# Altium schematic sheet FRAM.SchDoc
size 420 x 297 mm; DocumentNumber: 12; SheetNumber: 12; SheetTotal: 17
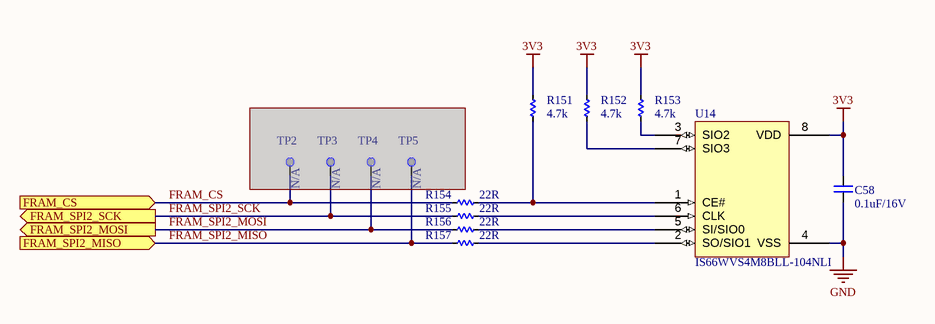
[diagram p0: FRAM.SchDoc]

## Parts
C58  0.1uF/16V  [CAP_C_1608X80]
R151  4.7k  [RES_C_1608X60]
R152  4.7k  [RES_C_1608X60]
R153  4.7k  [RES_C_1608X60]
R154  22R  [RES_C_1608X60]
R155  22R  [RES_C_1608X60]
R156  22R  [RES_C_1608X60]
R157  22R  [RES_C_1608X60]
TP2  Test Point  [TESTPOINT]  (value not drawn)  (no BOM)  (masked out: inside a compile mask, not in the netlist)
TP3  Test Point  [TESTPOINT]  (value not drawn)  (no BOM)  (masked out: inside a compile mask, not in the netlist)
TP4  Test Point  [TESTPOINT]  (value not drawn)  (no BOM)  (masked out: inside a compile mask, not in the netlist)
TP5  Test Point  [TESTPOINT]  (value not drawn)  (no BOM)  (masked out: inside a compile mask, not in the netlist)
U14  IS66WVS4M8BLL-104NLI  [SOIC8_150MIL_N_ISI]

## Ports
FRAM_CS (in), FRAM_SPI2_MISO (in), FRAM_SPI2_MOSI (out), FRAM_SPI2_SCK (out)

## Nets
3V3: C58.2 R151.2 R152.2 R153.2 U14.8(VDD)
GND: C58.1 U14.4(VSS)
FRAM_CS: R154.1 ; port FRAM_CS
FRAM_SPI2_MISO: R157.1 ; port FRAM_SPI2_MISO
FRAM_SPI2_MOSI: R156.1 ; port FRAM_SPI2_MOSI
FRAM_SPI2_SCK: R155.1 ; port FRAM_SPI2_SCK
NetR151_1: R151.1 R154.2 U14.1(CE#)
NetR152_1: R152.1 U14.7(SIO3)
NetR153_1: R153.1 U14.3(SIO2)
NetR155_2: R155.2 U14.6(CLK)
NetR156_2: R156.2 U14.5(SI/SIO0)
NetR157_2: R157.2 U14.2(SO/SIO1)

## Notes on the sheet
- Project:
- BEE-PC1
- Sub-system:
- NANORACK_EXP_CONTROLLER
- Design by:
- SANG HUYNH
- BAO BUI Q.
- Sheet title:
- Sheet
- A3
- of
- Checked by:
- Approved by:
- VU PHAM
- Revision:
- Document No:
- V1.2.2
- Size:
- Date:

## Library data of the parts
C58 = CAP_SMD: CAP_Chip; Value: 33pF
R151-R157 = _RES_B_2: RES
TP2-TP5 = MCD-00630: Test Point 0.3mm; Part_Type: Misc; Part_Preference: Recommended; Initial_Board_Reference: MB1264; ID: 3115; ShowFields: YES; Component_Country_Of_Origin: Unknown; Internal_Part_Number: MCD-00630; Status: Released; ECCN_US: n/a; ECCN_EU: n/a; Provided_By: n/a; Manufacturer: N/A; Manufacturer_Part_Number: N/A; Order_Code_Digikey: N/A; Order_Code_Farnell: N/A; Order_Code_RS: N/A; Value: N/A; ComponentLink1URL: http://tunmcdsvn.tun.st.com/Component_Documentation_Library/Trunk; Manufacturer_HQ_COO: Unknown
U14 = IS66WVS4M8BLL-104NLI: No Description Available; Manufacturer_Name: ISSI; Type: Memory; Copyright: Copyright (C) 2025 Ultra Librarian. All rights reserved.; Manufacturer_Part_Number: IS66WVS4M8BLL-104NLI; RefDes: RefDes